# Altium schematic sheet Schematic21_P1.schdoc
size 429 x 307 mm; Symbol: Sheet-Symbol_A4; Device: Sheet-Symbol_A4; Company: 嘉立创EDA; Version: V1.0; Page Size: A4; @Project Name: 卡林巴17键模拟器; @Page Count: 1; @Update Date: 2024-06-29; @Create Date: 2024-06-29; @Schematic Name: Schematic2; @Page No: 1; @Page Name: P1; Width: 1655; Height: 1170; Region Start: 1; X Region Count: 6; Y Region Count: 4; Blade Width: 10; Title Block Position: 3
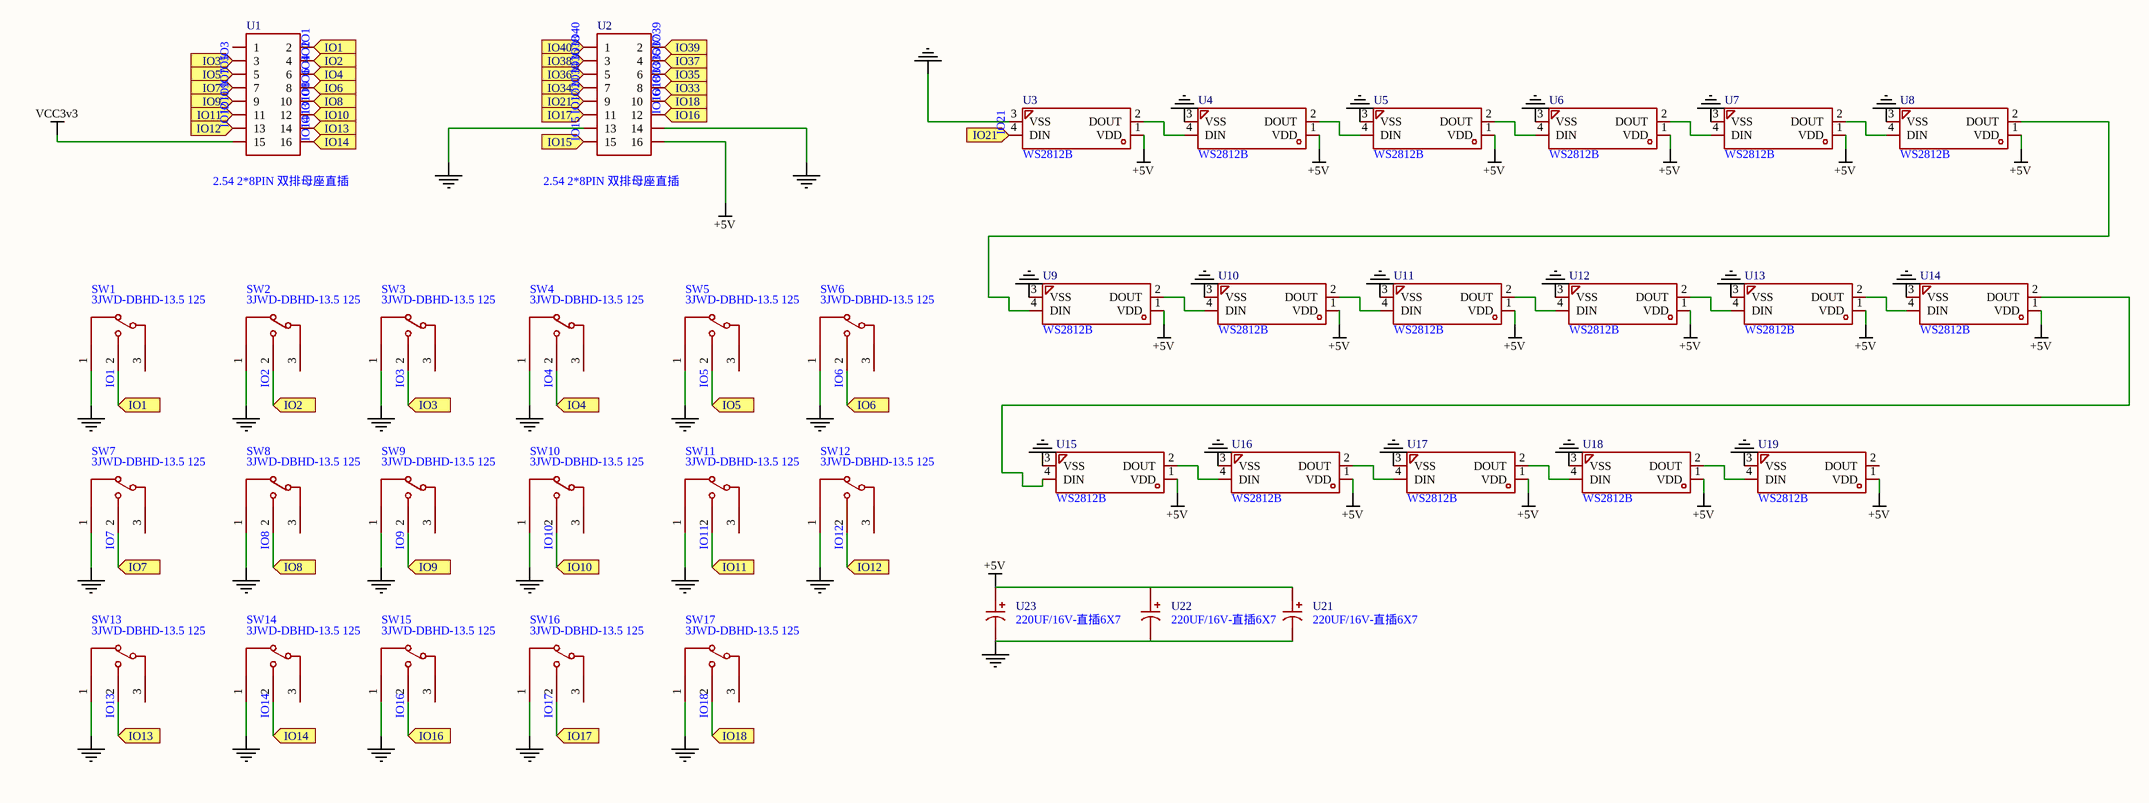
[diagram p0: Schematic21_P1.schdoc]

## Parts
SW1  3JWD-DBHD-13.5 125  [SW-TH_SHOU-HAN_3JWD-DBHD-13.5]
SW2  3JWD-DBHD-13.5 125  [SW-TH_SHOU-HAN_3JWD-DBHD-13.5]
SW3  3JWD-DBHD-13.5 125  [SW-TH_SHOU-HAN_3JWD-DBHD-13.5]
SW4  3JWD-DBHD-13.5 125  [SW-TH_SHOU-HAN_3JWD-DBHD-13.5]
SW5  3JWD-DBHD-13.5 125  [SW-TH_SHOU-HAN_3JWD-DBHD-13.5]
SW6  3JWD-DBHD-13.5 125  [SW-TH_SHOU-HAN_3JWD-DBHD-13.5]
SW7  3JWD-DBHD-13.5 125  [SW-TH_SHOU-HAN_3JWD-DBHD-13.5]
SW8  3JWD-DBHD-13.5 125  [SW-TH_SHOU-HAN_3JWD-DBHD-13.5]
SW9  3JWD-DBHD-13.5 125  [SW-TH_SHOU-HAN_3JWD-DBHD-13.5]
SW10  3JWD-DBHD-13.5 125  [SW-TH_SHOU-HAN_3JWD-DBHD-13.5]
SW11  3JWD-DBHD-13.5 125  [SW-TH_SHOU-HAN_3JWD-DBHD-13.5]
SW12  3JWD-DBHD-13.5 125  [SW-TH_SHOU-HAN_3JWD-DBHD-13.5]
SW13  3JWD-DBHD-13.5 125  [SW-TH_SHOU-HAN_3JWD-DBHD-13.5]
SW14  3JWD-DBHD-13.5 125  [SW-TH_SHOU-HAN_3JWD-DBHD-13.5]
SW15  3JWD-DBHD-13.5 125  [SW-TH_SHOU-HAN_3JWD-DBHD-13.5]
SW16  3JWD-DBHD-13.5 125  [SW-TH_SHOU-HAN_3JWD-DBHD-13.5]
SW17  3JWD-DBHD-13.5 125  [SW-TH_SHOU-HAN_3JWD-DBHD-13.5]
U1  2.54 2*8PIN 双排母座直插  [HDR-TH_16P-P2.54-V-F-R2-C8-S2.54-1]
U2  2.54 2*8PIN 双排母座直插  [HDR-TH_16P-P2.54-V-F-R2-C8-S2.54-1]
U3  WS2812B  [LED-SMD_4P-L5.0-W5.0-TL]
U4  WS2812B  [LED-SMD_4P-L5.0-W5.0-TL]
U5  WS2812B  [LED-SMD_4P-L5.0-W5.0-TL]
U6  WS2812B  [LED-SMD_4P-L5.0-W5.0-TL]
U7  WS2812B  [LED-SMD_4P-L5.0-W5.0-TL]
U8  WS2812B  [LED-SMD_4P-L5.0-W5.0-TL]
U9  WS2812B  [LED-SMD_4P-L5.0-W5.0-TL]
U10  WS2812B  [LED-SMD_4P-L5.0-W5.0-TL]
U11  WS2812B  [LED-SMD_4P-L5.0-W5.0-TL]
U12  WS2812B  [LED-SMD_4P-L5.0-W5.0-TL]
U13  WS2812B  [LED-SMD_4P-L5.0-W5.0-TL]
U14  WS2812B  [LED-SMD_4P-L5.0-W5.0-TL]
U15  WS2812B  [LED-SMD_4P-L5.0-W5.0-TL]
U16  WS2812B  [LED-SMD_4P-L5.0-W5.0-TL]
U17  WS2812B  [LED-SMD_4P-L5.0-W5.0-TL]
U18  WS2812B  [LED-SMD_4P-L5.0-W5.0-TL]
U19  WS2812B  [LED-SMD_4P-L5.0-W5.0-TL]
U21  220UF/16V-直插6X7  [CAP-TH_BD6.3-P2.50-D0.5-FD]
U22  220UF/16V-直插6X7  [CAP-TH_BD6.3-P2.50-D0.5-FD]
U23  220UF/16V-直插6X7  [CAP-TH_BD6.3-P2.50-D0.5-FD]

## Ports
IO1 (in), IO2 (in), IO3 (in), IO4 (in), IO5 (in), IO6 (in), IO7 (in), IO8 (in), IO9 (in), IO10 (in), IO11 (in), IO12 (in), IO13 (in), IO14 (in), IO15 (in), IO16 (in), IO17 (in), IO18 (in), IO21 (in), IO33 (in), IO34 (in), IO35 (in), IO36 (in), IO37 (in), IO38 (in), IO39 (in), IO40 (in)

## Nets
+5V: U2.16 U3.1(VDD) U4.1(VDD) U5.1(VDD) U6.1(VDD) U7.1(VDD) U8.1(VDD) U9.1(VDD) U10.1(VDD) U11.1(VDD) U12.1(VDD) U13.1(VDD) U14.1(VDD) U15.1(VDD) U16.1(VDD) U17.1(VDD) U18.1(VDD) U19.1(VDD) U21.1 U22.1 U23.1
GND: SW1.1(C) SW2.1(C) SW3.1(C) SW4.1(C) SW5.1(C) SW6.1(C) SW7.1(C) SW8.1(C) SW9.1(C) SW10.1(C) SW11.1(C) SW12.1(C) SW13.1(C) SW14.1(C) SW15.1(C) SW16.1(C) SW17.1(C) U2.13 U2.14 U3.3(VSS) U4.3(VSS) U5.3(VSS) U6.3(VSS) U7.3(VSS) U8.3(VSS) U9.3(VSS) U10.3(VSS) U11.3(VSS) U12.3(VSS) U13.3(VSS) U14.3(VSS) U15.3(VSS) U16.3(VSS) U17.3(VSS) U18.3(VSS) U19.3(VSS) U21.2 U22.2 U23.2
VCC3v3: U1.15
IO1: SW1.2(ON) U1.2 ; port IO1
IO2: SW2.2(ON) U1.4 ; port IO2
IO3: SW3.2(ON) U1.3 ; port IO3
IO4: SW4.2(ON) U1.6 ; port IO4
IO5: SW5.2(ON) U1.5 ; port IO5
IO6: SW6.2(ON) U1.8 ; port IO6
IO7: SW7.2(ON) U1.7 ; port IO7
IO8: SW8.2(ON) U1.10 ; port IO8
IO9: SW9.2(ON) U1.9 ; port IO9
IO10: SW10.2(ON) U1.12 ; port IO10
IO11: SW11.2(ON) U1.11 ; port IO11
IO12: SW12.2(ON) U1.13 ; port IO12
IO13: SW13.2(ON) U1.14 ; port IO13
IO14: SW14.2(ON) U1.16 ; port IO14
IO15: U2.15 ; port IO15
IO16: SW15.2(ON) U2.12 ; port IO16
IO17: SW16.2(ON) U2.11 ; port IO17
IO18: SW17.2(ON) U2.10 ; port IO18
IO21: U2.9 U3.4(DIN) ; port IO21
IO33: U2.8 ; port IO33
IO34: U2.7 ; port IO34
IO35: U2.6 ; port IO35
IO36: U2.5 ; port IO36
IO37: U2.4 ; port IO37
IO38: U2.3 ; port IO38
IO39: U2.2 ; port IO39
IO40: U2.1 ; port IO40
NetU3_2: U3.2(DOUT) U4.4(DIN)
NetU4_2: U4.2(DOUT) U5.4(DIN)
NetU5_2: U5.2(DOUT) U6.4(DIN)
NetU6_2: U6.2(DOUT) U7.4(DIN)
NetU7_2: U7.2(DOUT) U8.4(DIN)
NetU8_2: U8.2(DOUT) U9.4(DIN)
NetU9_2: U9.2(DOUT) U10.4(DIN)
NetU10_2: U10.2(DOUT) U11.4(DIN)
NetU11_2: U11.2(DOUT) U12.4(DIN)
NetU12_2: U12.2(DOUT) U13.4(DIN)
NetU13_2: U13.2(DOUT) U14.4(DIN)
NetU14_2: U14.2(DOUT) U15.4(DIN)
NetU15_2: U15.2(DOUT) U16.4(DIN)
NetU16_2: U16.2(DOUT) U17.4(DIN)
NetU17_2: U17.2(DOUT) U18.4(DIN)
NetU18_2: U18.2(DOUT) U19.4(DIN)

Not connected (* = marked no-connect by the designer): SW1 3(NC); SW2 3(NC); SW3 3(NC); SW4 3(NC); SW5 3(NC); SW6 3(NC); SW7 3(NC); SW8 3(NC); SW9 3(NC); SW10 3(NC); SW11 3(NC); SW12 3(NC); SW13 3(NC); SW14 3(NC); SW15 3(NC); SW16 3(NC); SW17 3(NC); U1 1; U19 2(DOUT)

## Notes on the sheet
- 1
- 2
- 3
- 4
- 5
- 6
- A
- B
- C
- 原理图
- Schematic2
- 创建日期
- 更新日期
- 2024-06-29
- D
- 绘制
- 图页
- P1
- 物料编码
- 审阅
- 版本
- 尺寸
- 卡林巴17键模拟器
- 页
- 共
- V1.0
- A4
- 嘉立创EDA

## Library data of the parts
SW1-SW17 = 3JWD-DBHD-13.5 125: Manufacturer: SHOU HAN(首韩); Add into BOM: yes; Symbol: 3JWD-DBHD-13.5 125; Device: 3JWD-DBHD-13.5 125; Convert to PCB: yes; LCSC Part Name: 3脚鼠标ETC专用微动开关 1A 125V 带柄柄长13.5mm 红点; Supplier Part: C2906291; Manufacturer Part: 3JWD-DBHD-13.5 125; Supplier Footprint: 插件; JLCPCB Part Class: 扩展库; Datasheet: https://atta.szlcsc.com/upload/public/pdf/source/20211019/52ACE125E0FDD69DD4046775F52831F0.pdf; Supplier: LCSC
U1 U2 = 2.54 2*8PIN 双排母座直插: Add into BOM: yes; Symbol: 2.54 2*8PIN 双排母座直插; Device: 2.54 2*8PIN 双排母座直插; LCSC Part Name: 2.54 2*8PIN 双排母座直插; Supplier Part: C9900000696; Manufacturer Part: 2.54 2*8PIN 双排母座直插; Supplier Footprint: TH-16_5.0X20.3X2.54P; JLCPCB Part Class: 扩展库; Supplier: LCSC; Convert to PCB: yes
U3-U19 = WS2812B_1: Symbol: WS2812B_C9900106807; Add into BOM: yes; Device: WS2812B_1; LCSC Part Name: WS2812B; Supplier Part: C9900106807; Manufacturer Part: WS2812B; Supplier Footprint: SMD-LED-5328; JLCPCB Part Class: 扩展库; Supplier: LCSC; Convert to PCB: yes
U21-U23 = 220UF/16V-直插6X7: Add into BOM: yes; Symbol: 220UF/16V-直插6X7; Device: 220UF/16V-直插6X7; LCSC Part Name: 220UF/16V-直插6X7; Supplier Part: C9900012263; Manufacturer Part: 220UF/16V-直插6X7; Supplier Footprint: CAP-TH; JLCPCB Part Class: 扩展库; Supplier: LCSC; Convert to PCB: yes